# Altium schematic sheet Connectors.SchDoc
size A4; SheetNumber: 2; SheetTotal: 4
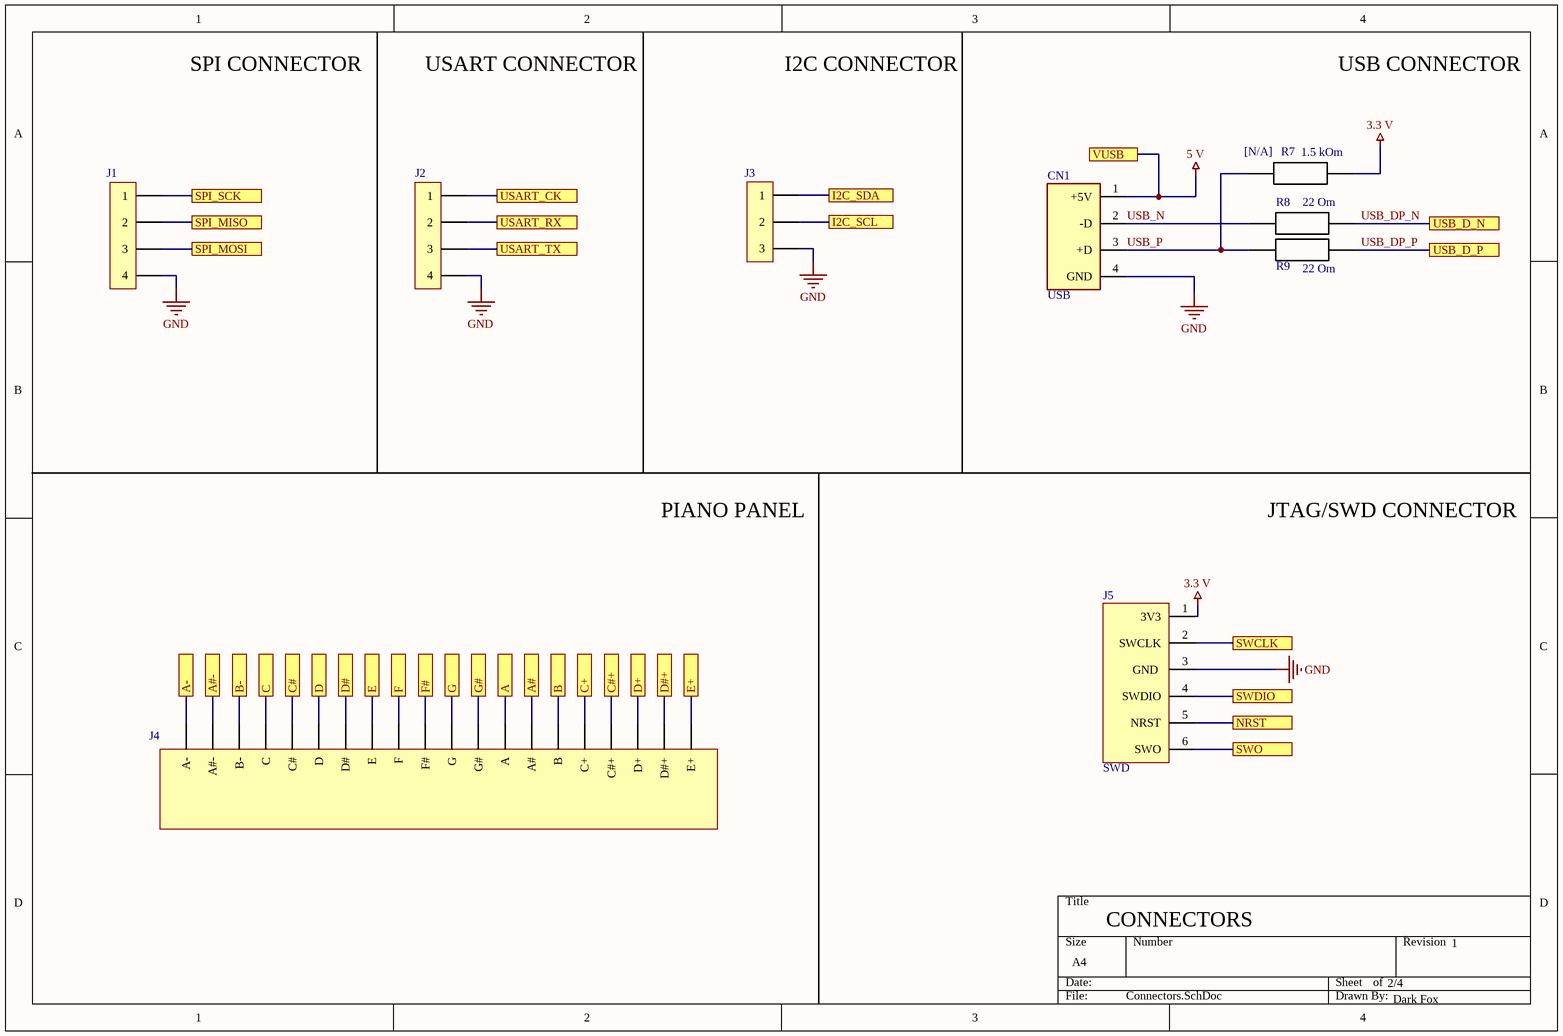
[diagram p0: Connectors.SchDoc]

## Parts
CN1  USB  [USB]
J1  4x2.54  [SMD 4x2.54]  (value not drawn)
J2  4x2.54  [SMD 4x2.54]  (value not drawn)
J3  3x2.54  [SMD 3x2.54]  (value not drawn)
J4  piano_full  [PIANO_FULL]  (value not drawn)
J5  SWD  [SWD_6_2.54]
R7  1.5 kOm  [1206]
R8  22 Om  [1206]
R9  22 Om  [1206]

## Ports
A, A#, A#-, A-, B, B-, C, C#, C#+, C+, D, D#, D#+, D+, E, E+, F, F#, G, G#, I2C_SCL, I2C_SDA, NRST, SPI_MISO, SPI_MOSI, SPI_SCK, SWCLK, SWDIO, SWO, USART_CK, USART_RX, USART_TX, USB_D_N, USB_D_P, VUSB

## Nets
3.3 V: J5.1(3V3) R7.2
5 V: CN1.1(+5V) ; port VUSB
GND: CN1.4(GND) J1.4 J2.4 J3.3 J5.3(GND)
A: J4.13(A) ; port A
A#: J4.14(A#) ; port A#
A#-: J4.2(A#-) ; port A#-
A-: J4.1(A-) ; port A-
B: J4.15(B) ; port B
B-: J4.3(B-) ; port B-
C: J4.4(C) ; port C
C#: J4.5(C#) ; port C#
C#+: J4.17(C#+) ; port C#+
C+: J4.16(C+) ; port C+
D: J4.6(D) ; port D
D#: J4.7(D#) ; port D#
D#+: J4.19(D#+) ; port D#+
D+: J4.18(D+) ; port D+
E: J4.8(E) ; port E
E+: J4.20(E+) ; port E+
F: J4.9(F) ; port F
F#: J4.10(F#) ; port F#
G: J4.11(G) ; port G
G#: J4.12(G#) ; port G#
I2C_SCL: J3.2 ; port I2C_SCL
I2C_SDA: J3.1 ; port I2C_SDA
NRST: J5.5(NRST) ; port NRST
SPI_MISO: J1.2 ; port SPI_MISO
SPI_MOSI: J1.3 ; port SPI_MOSI
SPI_SCK: J1.1 ; port SPI_SCK
SWCLK: J5.2(SWCLK) ; port SWCLK
SWDIO: J5.4(SWDIO) ; port SWDIO
SWO: J5.6(SWO) ; port SWO
USART_CK: J2.1 ; port USART_CK
USART_RX: J2.2 ; port USART_RX
USART_TX: J2.3 ; port USART_TX
USB_DP_N: R8.2 ; port USB_D_N
USB_DP_P: R9.2 ; port USB_D_P
USB_N: CN1.2(-D) R8.1
USB_P: CN1.3(+D) R7.1 R9.1

## Notes on the sheet
- SPI CONNECTOR
- USART CONNECTOR
- I2C CONNECTOR
- USB CONNECTOR
- (near R7) [N/A]
- PIANO PANEL
- JTAG/SWD CONNECTOR
- CONNECTORS
- 2/4
- 1
- Dark Fox

## Library data of the parts
CN1 = USB_2
R7-R9 = Res